# EAGLE design 4Bit Computer - 1 5LED Display (EAGLE 7.6.0)
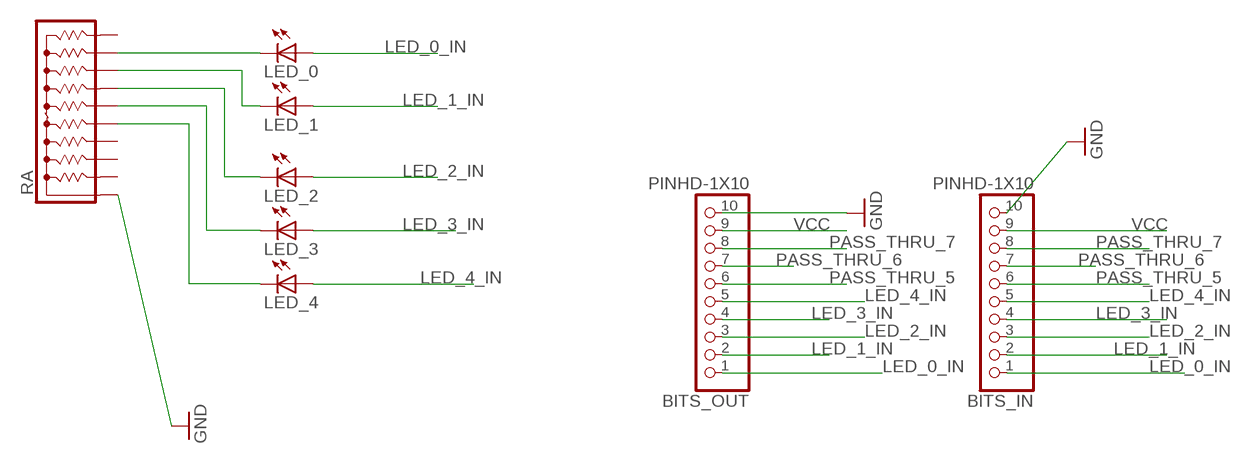
[diagram p0: schematic, sheet 1]

## Parts
BITS_IN  PINHD-1X10  [1X10-BIG]
BITS_OUT  PINHD-1X10  [1X10-BIG]
LED_0  LEDSMT1206  [1206]
LED_1  LEDSMT1206  [1206]
LED_2  LEDSMT1206  [1206]
LED_3  LEDSMT1206  [1206]
LED_4  LEDSMT1206  [1206]
RA  4610X  [SIP10]

## Nets
GND: BITS_IN.10 BITS_OUT.10 RA.1
LED_0_IN: BITS_IN.1 BITS_OUT.1 LED_0.A
LED_1_IN: BITS_IN.2 BITS_OUT.2 LED_1.A
LED_2_IN: BITS_IN.3 BITS_OUT.3 LED_2.A
LED_3_IN: BITS_IN.4 BITS_OUT.4 LED_3.A
LED_4_IN: BITS_IN.5 BITS_OUT.5 LED_4.A
N$1: LED_0.C RA.9
N$2: LED_1.C RA.8
N$3: LED_2.C RA.7
N$4: LED_3.C RA.6
N$5: LED_4.C RA.5
PASS_THRU_5: BITS_IN.6 BITS_OUT.6
PASS_THRU_6: BITS_IN.7 BITS_OUT.7
PASS_THRU_7: BITS_IN.8 BITS_OUT.8
VCC: BITS_IN.9 BITS_OUT.9
Unconnected: RA.2 RA.3 RA.4 RA.10

## Library data of the parts
BITS_IN BITS_OUT = adafruit:PINHD-1X10: Pin header 1x10 0.1" spacing With round pins
LED_0 LED_1-LED_4 = adafruit:LED: LED OSRAM: - CHIPLED LG R971, LG N971, LY N971, LG Q971, LY Q971, LO R971, LY R971 LH N974, LH R974 LS Q976, LO Q976, LY Q976 LO Q996 - Hyper CHIPLED LW Q18S LB Q993, LB Q99A, LB R99A - SideLED LS A670, LO A670, LY A670, LG A670, LP A670 LB A673, LV A673, LT A673, LW A673 LH A674 LY A675 LS A676, LA A676, LO A676, LY A676, LW A676 LS A679, LY A679, LG A679 - Hyper Micro SIDELED® LS Y876, LA Y876, LO Y876, LY Y876 LT Y87S - SmartLED LW L88C, LW L88S LB L89C, LB L89S, LG L890 LS L89K, LO L89K, LY L89K LS L896, LA L896, LO L896, LY L896 - TOPLED LS T670, LO T670, LY T670, LG T670, LP T670 LSG T670, LSP T670, LSY T670, LOP T670, LYG T670 LG T671, LOG T671, LSG T671 LB T673, LV T673, LT T673, LW T673 LH T674 LS T676, LA T676, LO T676, LY T676, LB T676, LH T676, LSB T676, LW T676 LB T67C, LV T67C, LT T67C, LS T67K, LO T67K, LY T67K, LW E67C LS E67B, LA E67B, LO E67B, LY E67B, LB E67C, LV E67C, LT E67C LW T67C LS T679, LY T679, LG T679 LS T770, LO T770, LY T770, LG T770, LP T770 LB T773, LV T773, LT T773, LW T773 LH T774 LS E675, LA E675, LY E675, LS T675 LS T776, LA T776, LO T776, LY T776, LB T776 LHGB T686 LT T68C, LB T68C - Hyper Mini TOPLED® LB M676 - Mini TOPLED Santana® LG M470 LS M47K, LO M47K, LY M47K Source: http://www.osram.convergy.de/
RA = resistor-sip:4610X: Bourns 4600X Series - Thick Film Conformal SIPs 4610X-101 Resistor Network Configuration: 101 (Bussed Resistors) Resistance range: 10 ohms to 10 Megaohms Maximum Operating Voltage: 100V Source: http://www.bourns.com/ProductLine.aspx?name=standard_thick_film_networks PDF: http://www.bourns.com/data/global/pdfs/4600X.pdf

## Board
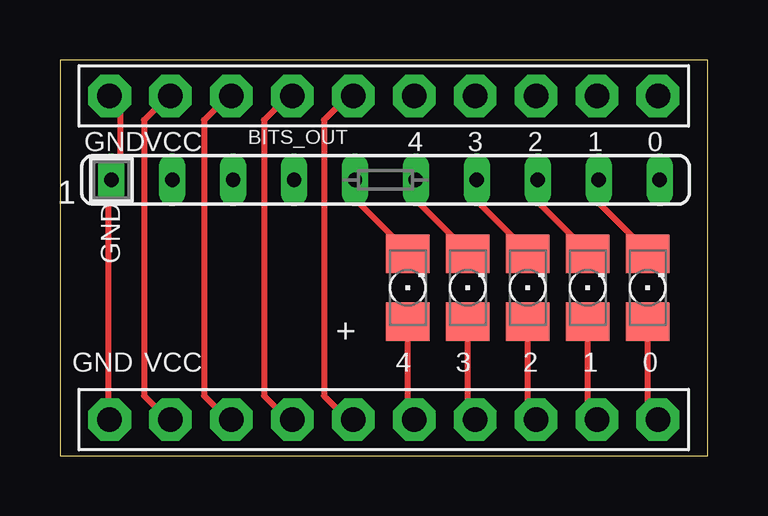
[diagram p1: board, top side]
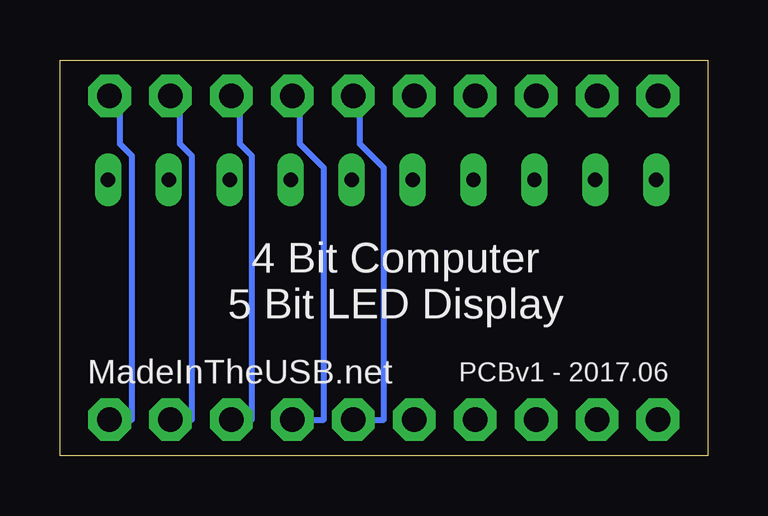
[diagram p2: board, bottom side, seen from below]

Size 27 x 16.5 mm. Coordinates in mm from the lower left corner, seen from the top.
Outline: 0,0 27,0 27,16.5 0,16.5 0,0
Copper layers (1*16): Top 0.035mm / dielectric 1.5mm / Bottom 0.035mm
Design rules "default": minimum track width 10mil, minimum drill 24mil, track to track 8mil, track to pad 8mil, pad to pad 8mil, via to via 8mil, smd to smd 8mil, copper to edge 40mil, drill to drill 8mil, minimum pad ring 10mil, minimum via ring 8mil, stop-mask expansion 4mil, vias tented up to drill 0mil, thermal gap 10mil

### Footprints (pad centres in the part's own frame; a part is rotated, then mirrored left to right if it is on the bottom)
1X10-BIG = drill 1.016 pad 1.778 octagon: 1 -11.43,0; 2 -8.89,0; 3 -6.35,0; 4 -3.81,0; 5 -1.27,0; 6 1.27,0; 7 3.81,0; 8 6.35,0; 9 8.89,0; 10 11.43,0
1206 = smd 1.6 x 1.803: A -1.422,0; C 1.422,0
SIP10 = drill 0.6 long: 1 -11.46,0; 2 -8.92,0; 3 -6.38,0; 4 -3.84,0; 5 -1.3,0; 6 1.24,0; 7 3.78,0; 8 6.32,0; 9 8.86,0; 10 11.4,0

### Placement (x,y rotation side)
BITS_IN  13.5,1.5 180 top
BITS_OUT  13.5,15 180 top
LED_0  24.5,7 90 top
LED_1  22,7 90 top
LED_2  19.5,7 90 top
LED_3  17,7 90 top
LED_4  14.5,7 90 top
RA  13.6,11.5 0 top

### Tracks (layer width: path | path; a pad name or v marks a point on that pad's centre or on a via)
GND
  Top 0.254: BITS_OUT.10 2.5,15 2.5,11.5 RA.1 2,11.5 2,1.5 BITS_IN.10
LED_0_IN
  Top 0.254: LED_0.A 24.5,1.5 BITS_IN.1
  Bottom 0.254: BITS_IN.1 24,1.5 24,12.5 24.5,13 24.5,15 BITS_OUT.1
LED_1_IN
  Top 0.254: LED_1.A 22,1.5 BITS_IN.2
  Bottom 0.254: BITS_IN.2 21.5,1.5 21.5,12.5 22,13 22,15 BITS_OUT.2
LED_2_IN
  Top 0.254: LED_2.A 19.5,1.5 BITS_IN.3
  Bottom 0.254: BITS_IN.3 19,1.5 19,12.5 19.5,13 19.5,15 BITS_OUT.3
LED_3_IN
  Top 0.254: LED_3.A 17,1.5 BITS_IN.4
  Bottom 0.254: BITS_IN.4 16,1.5 16,12 17,13 17,15 BITS_OUT.4
LED_4_IN
  Top 0.254: LED_4.A 14.5,1.5 BITS_IN.5
  Bottom 0.254: BITS_IN.5 13.5,1.5 13.5,12 14.5,13 14.5,15 BITS_OUT.5
N$1
  Top 0.254: LED_0.C 24.5,8.5 22.5,10.5 22.5,11.5 RA.9
N$2
  Top 0.254: LED_1.C 22,8.5 20,10.5 20,11.5 RA.8
N$3
  Top 0.254: LED_2.C 19.5,8.5 17.5,10.5 17.5,11.5 RA.7
N$4
  Top 0.254: LED_3.C 17,8.5 15,10.5 15,11.5 RA.6
N$5
  Top 0.254: LED_4.C 14.5,8.5 12.5,10.5 12.5,11.5 RA.5
PASS_THRU_5
  Top 0.254: BITS_IN.6 12,1.5 11,2.5 11,14 12,15 BITS_OUT.6
PASS_THRU_6
  Top 0.254: BITS_IN.7 9.5,1.5 8.5,2.5 8.5,14 9.5,15 BITS_OUT.7
PASS_THRU_7
  Top 0.254: BITS_IN.8 7,1.5 6,2.5 6,14 7,15 BITS_OUT.8
VCC
  Top 0.254: BITS_IN.9 4.5,1.5 3.5,2.5 3.5,14 4.5,15 BITS_OUT.9

### Text on the board
tNames: GND | VCC | 4 | 3 | 2 | 1 | 0 | GND | + | GND | VCC | 4 | 3 | 2 | 1 | 0
bNames: 4 Bit Computer / 5 Bit LED Display | PCBv1 - 2017.06 | MadeInTheUSB.net